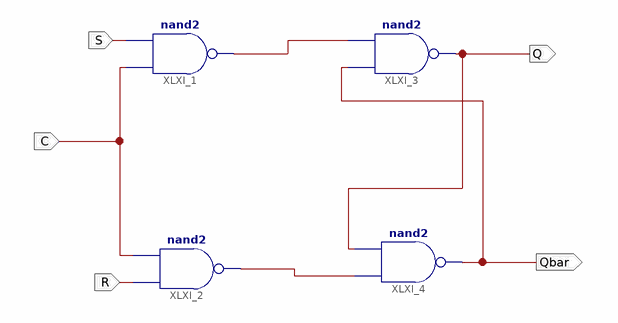
[diagram p0: schematic sheet 1]
// Xilinx ISE schematic CSR_LATCH.sch (kintex7) as structural Verilog: 4 symbols, 5 ports
module CSR_LATCH (
  input  S,
  input  R,
  input  C,
  output Q,
  output Qbar
);

  wire XLXN_6, XLXN_7;

  nand XLXI_1 (XLXN_6, C, S);
  nand XLXI_2 (XLXN_7, R, C);
  nand XLXI_3 (Q, Qbar, XLXN_6);
  nand XLXI_4 (Qbar, XLXN_7, Q);
endmodule
